# Altium schematic sheet TVR_Rev2_Sensors_Actuators.SchDoc
size A4; SheetNumber: 2; SheetTotal: 4
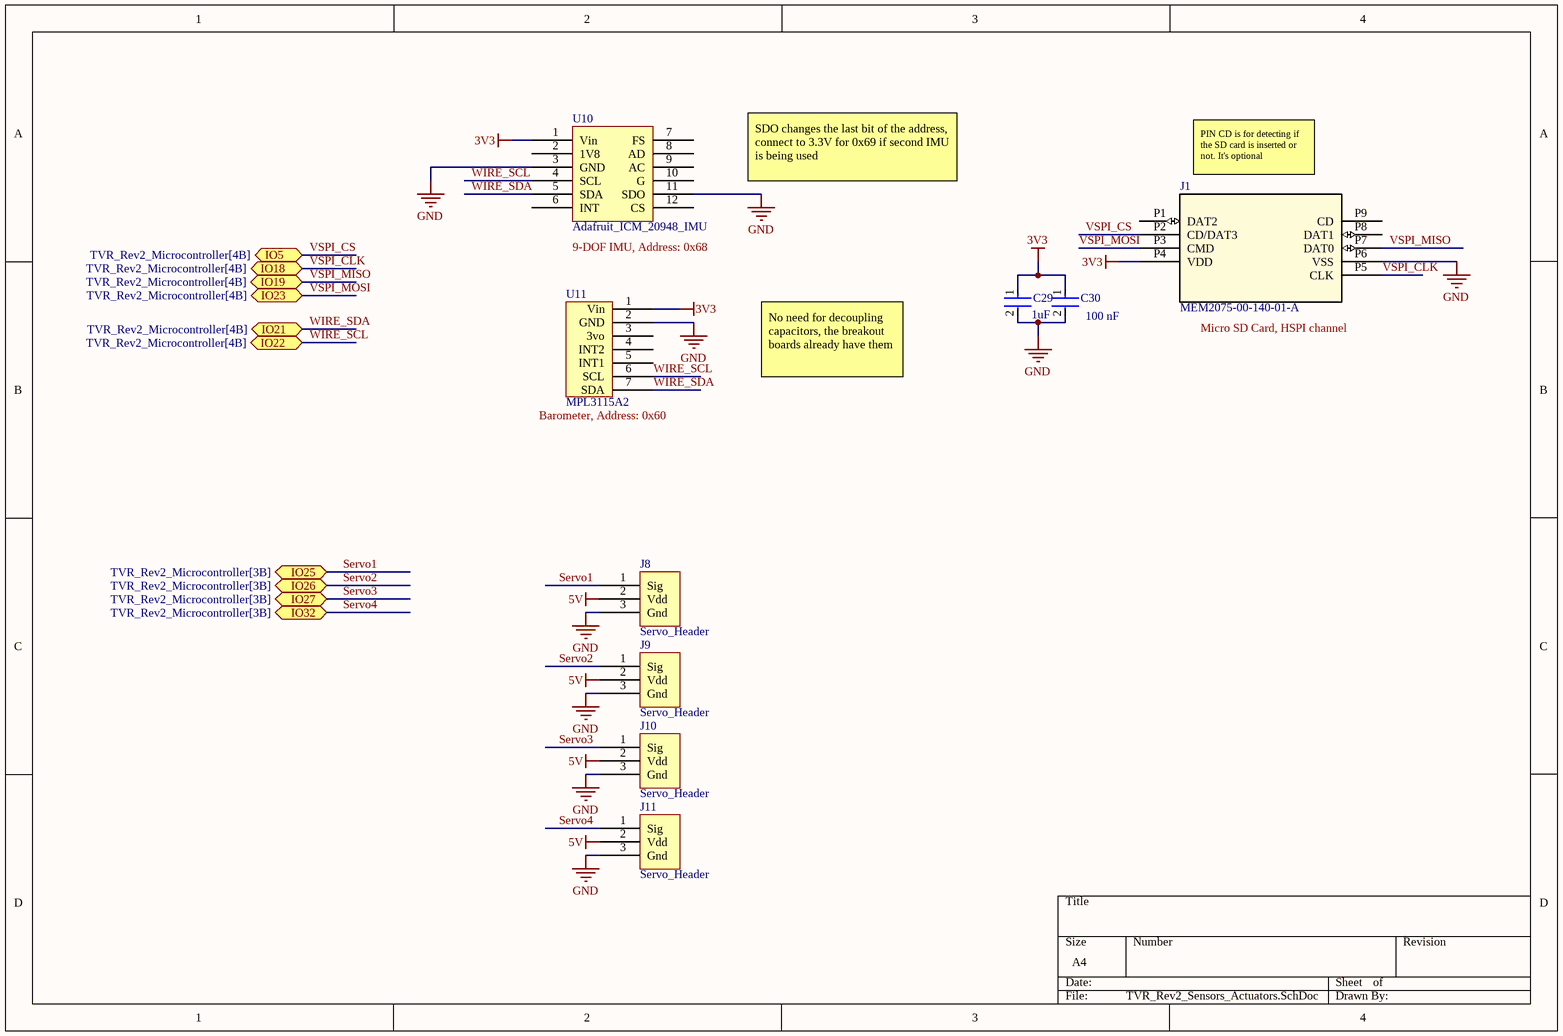
[diagram p0: TVR_Rev2_Sensors_Actuators.SchDoc]

## Parts
C29  Capacitance: 1uF  [FP-0805-L_2_01_0_2-W_1_25-MFG]  (hidden comment: 08055C105KAT2A)
C30  Capacitance: 100 nF  [FP-CC0805-0_85-MFG]  (hidden comment: CC0805KRX7R9BB104)
J1  MEM2075-00-140-01-A  [MEM2075-00-140-01-A_GCT]
J8  Servo_Header  [ServoHeader]
J9  Servo_Header  [ServoHeader]
J10  Servo_Header  [ServoHeader]
J11  Servo_Header  [ServoHeader]
U10  Adafruit_ICM_20948_IMU  [Adafruit_ICM_20948_IMU]
U11  MPL3115A2  [MPL3115A2_DIP]

## Ports
IO5 (bidir, see TVR_Rev2_Microcontroller[4B]), IO18 (bidir, see TVR_Rev2_Microcontroller[4B]), IO19 (bidir, see TVR_Rev2_Microcontroller[4B]), IO21 (bidir, see TVR_Rev2_Microcontroller[4B]), IO22 (bidir, see TVR_Rev2_Microcontroller[4B]), IO23 (bidir, see TVR_Rev2_Microcontroller[4B]), IO25 (bidir, see TVR_Rev2_Microcontroller[3B]), IO26 (bidir, see TVR_Rev2_Microcontroller[3B]), IO27 (bidir, see TVR_Rev2_Microcontroller[3B]), IO32 (bidir, see TVR_Rev2_Microcontroller[3B])

## Nets
3V3: C29.1 C30.1 J1.P4(VDD) U10.1(Vin) U11.1(Vin)
5V: J8.2(Vdd) J9.2(Vdd) J10.2(Vdd) J11.2(Vdd)
GND: C29.2 C30.2 J1.P6(VSS) J8.3(Gnd) J9.3(Gnd) J10.3(Gnd) J11.3(Gnd) U10.3(GND) U10.11(SDO) U11.2(GND)
Servo1: J8.1(Sig) ; port IO25
Servo2: J9.1(Sig) ; port IO26
Servo3: J10.1(Sig) ; port IO27
Servo4: J11.1(Sig) ; port IO32
VSPI_CLK: J1.P5(CLK) ; port IO18
VSPI_CS: J1.P2(CD/DAT3) ; port IO5
VSPI_MISO: J1.P7(DAT0) ; port IO19
VSPI_MOSI: J1.P3(CMD) ; port IO23
WIRE_SCL: U10.4(SCL) U11.6(SCL) ; port IO22
WIRE_SDA: U10.5(SDA) U11.7(SDA) ; port IO21

Not connected (* = marked no-connect by the designer): J1 P1(DAT2) P8(DAT1) P9(CD); U10 2(1V8) 6(INT) 7(FS) 8(AD) 9(AC) 10(G) 12(CS); U11 3(3vo) 4(INT2) 5(INT1)

## Notes on the sheet
- SDO changes the last bit of the address, connect to 3.3V for 0x69 if second IMU is being used
- (near J1) PIN CD is for detecting if the SD card is inserted or not. It's optional
- 9-DOF IMU, Address: 0x68
- No need for decoupling capacitors, the breakout boards already have them
- (near J1) Micro SD Card, HSPI channel
- (near U11) Barometer, Address: 0x60

## Library data of the parts
C29 = CMP-2007-04696-2: General Purpose Ceramic Capacitor, 0805, 1uF, 10%, X7R, 15%, 50V; Dissipation Factor: 2.5%; Packaging: Tape and Reel; Lead Free: Lead Free; Contact Plating: Tin; Dielectric: X7R; Tolerance: 10%; REACH SVHC: No SVHC; Voltage Rating (DC): 50V; Depth: 1.25mm; Voltage Rating: 50V; Radiation Hardening: No; Case Code (Metric): 2012; Width: 0.049inch; Package Quantity: 1; Mount: Surface Mount; Length: 2.01mm; Series: -; Thickness: 0.037inch; Max Operating Temperature: 125°C; RoHS Compliant: Yes; Termination: SMD/SMT; Case/Package: 0805; Min Operating Temperature: -55°C; Voltage: 50V; Case Code (Imperial): 0805
C30 = CMP-2100-03606-3: CAP CER 0.1UF 50V X7R 0805; Manufacturer: Yageo; Tolerance: 0.1; Value: 100 nF; Material: Ceramic; Device Class L1: Passive Components; ComponentLink2Description: Datasheet; Package: CC0805-0.85; Manufacturer Part Number: CC0805KRX7R9BB104; Digikey Description: CAP CER 0.1UF 50V X7R 0805; Device Class L3: Ceramic Capacitors; Temperature: -30°C to +85°C; Temperature Characteristic: X7R; Voltage Rating: 50 V; Height: 0.95mm; RoHS: TRUE; Ipc Land Pattern Name: CAPC200125X85; Device Class L2: Capacitors; Category: Cap; Temperature Range Low: -30°C; Temperature Range High: +85°C; Mouser Description: Multilayer Ceramic Capacitors MLCC - SMD/SMT 100nF 50V X7R 10%; Footprint Url: http://www.yageo.com/exep/pages/download/literatures/UPY-C_GEN_24.pdf; Automotive: No; Octopart: https://octopart.com/cc0805krx7r9bb104-yageo-192993; Lead Free: Yes; ComponentLink2URL: http://www.yageo.com/documents/recent/UPY-GPHC_Y5V_6.3V-to-50V_8.pdf
J1 = MEM2075-00-140-01-A: No Description Available; Mfr_Name: Global Connector Technology; RefDes: RefDes; Type: Type